# Altium schematic sheet Sheet3.SchDoc
size A
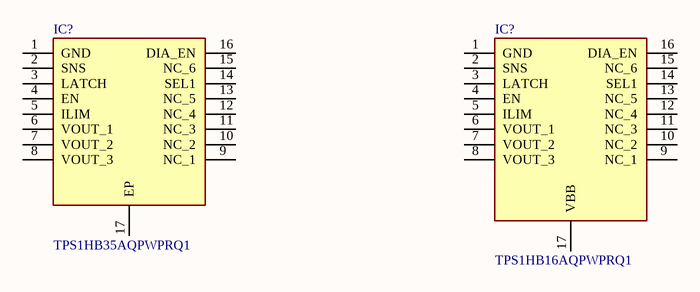
[diagram p0: Sheet3.SchDoc]

## Parts
(Parts that share a designator on the sheet are numbered #1, #2 ... from top to bottom, then left to right.)
IC?#1  TPS1HB35AQPWPRQ1  [SOP65P640X120-17N]
IC?#2  TPS1HB16AQPWPRQ1  [SOP65P640X120-17N]

## Nets

Not connected (* = marked no-connect by the designer): IC?#1 1(GND) 2(SNS) 3(LATCH) 4(EN) 5(ILIM) 6(VOUT_1) 7(VOUT_2) 8(VOUT_3) 9(NC_1) 10(NC_2) 11(NC_3) 12(NC_4) 13(NC_5) 14(SEL1) 15(NC_6) 16(DIA_EN) 17(EP); IC?#2 1(GND) 2(SNS) 3(LATCH) 4(EN) 5(ILIM) 6(VOUT_1) 7(VOUT_2) 8(VOUT_3) 9(NC_1) 10(NC_2) 11(NC_3) 12(NC_4) 13(NC_5) 14(SEL1) 15(NC_6) 16(DIA_EN) 17(VBB)

## Library data of the parts
IC?#1 = TPS1HB35AQPWPRQ1: Integrated Circuit; Manufacturer_Name: Texas Instruments; Datasheet Link: https://www.ti.com/lit/ds/symlink/tps1hb35-q1.pdf?ts=1623228312677&ref_url=https%253A%252F%252Fwww.google.com%252F; Height: 1.2mm; Manufacturer_Part_Number: TPS1HB35AQPWPRQ1; Mouser Part Number: 595-TPS1HB35AQPWPRQ1; Mouser Price/Stock: https://www.mouser.co.uk/ProductDetail/Texas-Instruments/TPS1HB35AQPWPRQ1?qs=KUoIvG%2F9IlYFS2ZDCuDTOg%3D%3D
IC?#2 = TPS1HB16AQPWPRQ1: Integrated Circuit; Manufacturer_Name: Texas Instruments; Datasheet Link: https://www.ti.com/lit/ds/symlink/tps1hb16-q1.pdf?ts=1598538997170&ref_url=https%253A%252F%252Fwww.ti.com%252Fproduct%252FTPS1HB16-Q1; Height: 1.2mm; Manufacturer_Part_Number: TPS1HB16AQPWPRQ1; Mouser Part Number: 595-TPS1HB16AQPWPRQ1; Mouser Price/Stock: https://www.mouser.co.uk/ProductDetail/Texas-Instruments/TPS1HB16AQPWPRQ1?qs=vmHwEFxEFR9VMSMq1HvLwg%3D%3D